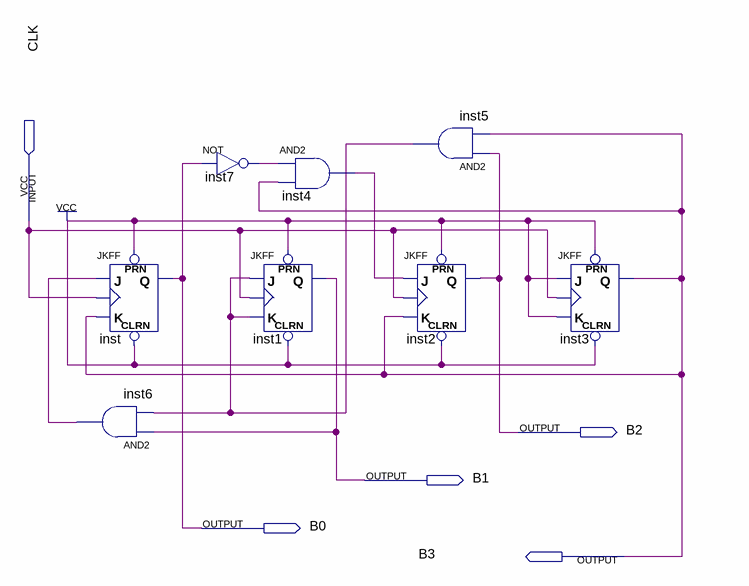
[diagram p0: schematic sheet]
// Quartus schematic exercicio-2.bdf as structural Verilog: 8 symbols, 5 pins
module \exercicio-2  (
  input  CLK,
  output B2,
  output B1,
  output B0,
  output B3
);

  wire inst4_out, inst5_out, inst6_out, inst7_out;

  JKFF inst (.PRN(1'b1), .CLRN(1'b1), .K(B3), .J(inst6_out), .CLK(CLK), .Q(B0));
  and inst6 (inst6_out, B1, inst5_out);
  not inst7 (inst7_out, B0);
  JKFF inst1 (.PRN(1'b1), .CLRN(1'b1), .K(inst5_out), .J(inst5_out), .CLK(CLK), .Q(B1));
  and inst4 (inst4_out, inst7_out, B3);
  and inst5 (inst5_out, B2, B3);
  JKFF inst2 (.PRN(1'b1), .CLRN(1'b1), .K(B3), .J(inst4_out), .CLK(CLK), .Q(B2));
  JKFF inst3 (.PRN(1'b1), .CLRN(1'b1), .K(1'b1), .J(1'b1), .CLK(CLK), .Q(B3));
endmodule
